# EAGLE schematic power circuit2 (EAGLE 7.3.0)
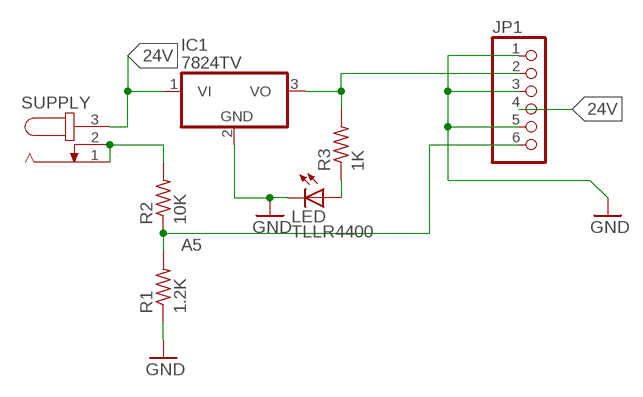
[diagram p0: schematic, sheet 1]

## Parts
IC1  7824TV  [TO220V]
JP1  PINHD-1X6B  [1X06-BIG]
LED  TLLR4400  [LED3MM]
R1  1.2K  R-US_0207/5V  [0207/5V]
R2  10K  R-US_0207/5V  [0207/5V]
R3  1K  R-US_0207/5V  [0207/5V]
SUPPLY  JACK-PLUG1  [SPC4078]

## Nets
24V: IC1.1(VI) JP1.4 SUPPLY.3
A5: JP1.6 R1.2 R2.1
GND: IC1.2(GND) JP1.1 JP1.3 JP1.5 LED.K(C) R1.1
N$1: LED.A R3.1
N$2: IC1.3(VO) JP1.2 R3.2
N$4: R2.2 SUPPLY.1 SUPPLY.2

## Library data of the parts
IC1 = linear:78*: Positive VOLTAGE REGULATOR Source: http://cache.national.com/ds/LM/LM78L05.pdf http://www.fairchildsemi.com/ds/LM/LM7805.pdf
JP1 = adafruit:PINHD-1X6: PIN HEADER
LED = led:TLLR4400: Low Current (2mA) LED 3 mm Tinted Diffused Package color RED Source: Data sheet <http://www.farnell.com/datasheets/391100.pdf>; MF: VISHAY SEMICONDUCTOR; OC_FARNELL: 1612437
R1-R3 = adafruit:R-US_: RESISTOR, American symbol
SUPPLY = con-jack:JACK-PLUG: DC POWER JACK Power Jack, DC, Right Angle, Through Hole, Rated 5A at 16VDC, PC Terminals Distributor: Farnell (www.Farnell.de) Drawing: 84N1161.pdf / 84N1162.pdf Manufacturer: SPC Technology (www.spctechnology.com) Type: SPC4077 / SPC 4078; OC_FARNELL: unknown; OC_NEWARK: unknown